# Altium schematic sheet 5v_power.SchDoc: 5V Power Regulator
size A4; Organization: OSURC Mars Rover; DocumentNumber: 8; Revision: 1; SheetNumber: 8; SheetTotal: 12
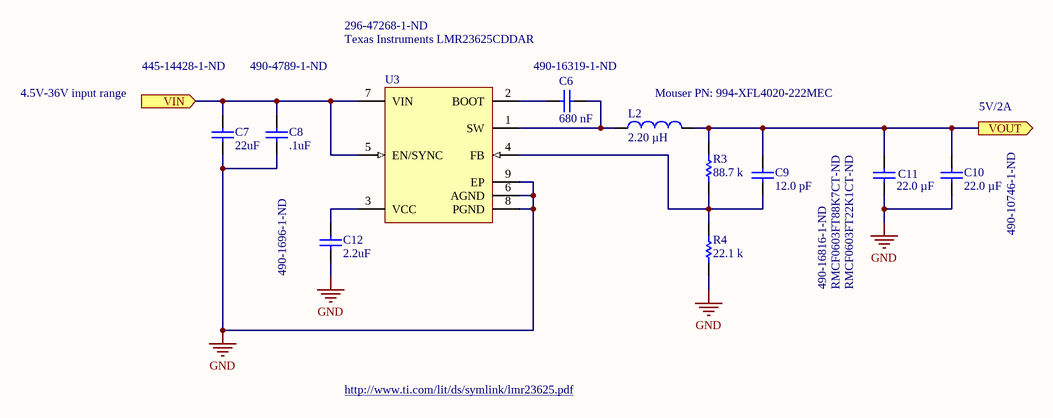
[diagram p0: 5v_power.SchDoc]

## Parts
C6  Capacitance: 680 nF  [PCB-xrh88671zmf2jss4mnlt-1]  (hidden comment: Murata GRM21BR71H684KAC4L)
C7  Capacitance: 22uF  [PCB-lllx3wppxbec679u3f24-1]  (hidden comment: Cap)
C8  Capacitance: .1uF  [CAPC2013X140X45ML15T25]  (hidden comment: Murata GCM21BR72A104KA37L)
C9  Capacitance: 12.0 pF  [PCB-xrh88671zmf2jss4mnlt-1]  (hidden comment: Murata GRM21A5C2D120JW01D)
C10  Capacitance: 22.0 µF  [PCB-xrh88671zmf2jss4mnlt-1]  (hidden comment: Murata GRM21BR61A226ME44L)
C11  Capacitance: 22.0 µF  [PCB-xrh88671zmf2jss4mnlt-1]  (hidden comment: Murata GRM21BR61A226ME44L)
C12  Capacitance: 2.2uF  [CAPC2013X135X50LL10T20]  (hidden comment: Murata GRM21BR71A225KA01L)
L2  Inductance: 2.20 µH  [PCB-9d9k809zadibtjsjgh1m-1]  (hidden comment: Coilcraft XFL4020-222MEC)
R3  Resistance: 88.7 k  [PCB-9ahxsq8gddjqcnfjmojj-1]  (hidden comment: Stackpole Electronics RMCF0603FT88K7)
R4  Resistance: 22.1 k  [PCB-9ahxsq8gddjqcnfjmojj-1]  (hidden comment: Stackpole Electronics RMCF0603FT22K1)
U3  Texas Instruments LMR23625CDDAR  [PCB-d70mjtd98i3vq9jo7u2s-1]

## Ports
VIN (in), VOUT (out)

## Nets
GND: C7.2 C8.2 C10.1 C11.1 C12.1 R4.1 U3.6(AGND) U3.8(PGND) U3.9(EP)
VIN: C7.1 C8.1 U3.5(EN/SYNC) U3.7(VIN) ; port VIN
VOUT: C9.2 C10.2 C11.2 L2.2 R3.1 ; port VOUT
NetC6_1: C6.1 L2.1 U3.1(SW)
NetC6_2: C6.2 U3.2(BOOT)
NetC9_1: C9.1 R3.2 R4.2 U3.4(FB)
NetC12_2: C12.2 U3.3(VCC)

## Notes on the sheet
- 445-14428-1-ND
- 490-4789-1-ND
- 296-47268-1-ND
- (near C6) 490-16319-1-ND
- 4.5V-36V input range
- (near L2) Mouser PN: 994-XFL4020-222MEC
- 5V/2A
- 490-1696-1-ND
- 490-16816-1-ND
- (near C11) RMCF0603FT88K7CT-ND
- (near C11) RMCF0603FT22K1CT-ND
- 490-10746-1-ND
- http://www.ti.com/lit/ds/symlink/lmr23625.pdf
- Title
- Size:
- Date:
- A4
- Engineer:
- Time:
- Sheet
- Revision:
- of
- File:

## Library data of the parts
C6 = CMP-44008e6100d59bc7-1: Cap Ceramic 0.68uF 50V X7R 10% Pad SMD 0805 125C T/R; Case/Package (SI): 2012; Voltage Rating (DC): 50.0 V; Octopart URL: https://octopart.com/grm21br71h684kac4l-murata-57369011; Manufacturer Part Number: GRM21BR71H684KAC4L; Capacitance Tolerance: ±10%; Case/Package: 0805; Dielectric Characteristic: X7R; Lifecycle Status: Active; RoHS: Compliant; Size-Length: 2.00 mm; Size-Thickness: 1.25 mm; Size-Width: 1.25 mm; OctopartID: 44008e6100d59bc7
C7 = CMP-0d44c5e3fbabd283-1: C Series 0805 22 uF 35 V ±20 % Tolerance X5R SMT Multilayer Ceramic Capacitor; Manufacturer Part Number: C2012X5R1V226M125AC; Capacitance Tolerance: ±20%; Case/Package: 0805; OctopartID: 0d44c5e3fbabd283
C8 = CMP-120358-2: CAP CER 0.1UF 100V 10% X7R 0805; Lead-Free Status: Lead Free; Voltage Rating (DC): 100.0 V; Capacitance Tolerance: ±10%; Case/Package: 0805; Dielectric Characteristic: X7R; Octopart Url: https://octopart.com/gcm21br72a104ka37l-murata-7894859; OctopartID: e2342b46b0193df3; REACH SVHC Compliance: No SVHC; RoHS: Compliant
C9 = CMP-50dd9b1f09f28f1a-1: Cap Ceramic 12pF 200V C0G 5% SMD 0805 125°C Paper T/R; Dielectric Characteristic: C0G/NP0; Octopart URL: https://octopart.com/grm21a5c2d120jw01d-murata-46693449; Manufacturer Part Number: GRM21A5C2D120JW01D; Capacitance Tolerance: ±5%; Case/Package: 0805; Mounting Style: Surface Mount; Packaging: Tape & Reel (TR); RoHS: Compliant; Size-Length: 2.00 mm; Size-Thickness: 1.00 mm; Size-Width: 1.25 mm; Voltage Rating (DC): 200 V; OctopartID: 50dd9b1f09f28f1a
C10 C11 = CMP-7d69b6ab24aca2ae-1: 0805 22 uF 10 V ±20% Tolerance X5R Multilayer Ceramic Chip Capacitor; Case/Package (SI): 2012; Lead-Free Status: Lead Free; Voltage Rating (DC): 10.0 V; Octopart URL: https://octopart.com/grm21br61a226me44l-murata-46693539; Manufacturer Part Number: GRM21BR61A226ME44L; Capacitance Tolerance: ±20%; Case/Package: 0805; Dielectric Characteristic: X5R; Lifecycle Status: Active; RoHS: Compliant; Size-Length: 2.00 mm; Size-Thickness: 1.25 mm; Size-Width: 1.25 mm; OctopartID: 7d69b6ab24aca2ae
C12 = CMP-19299739-2: CAP CER 2.2UF 10V 10% X7R 0805; Case/Package (SI): 2012; Lead-Free Status: Lead Free; Voltage Rating (DC): 10.0 V; Capacitance Tolerance: ±10%; Dielectric Characteristic: X7R; Lifecycle Status: Active; Mounting Style: Surface Mount; Number of Pins: 2; Octopart Url: https://octopart.com/grm21br71a225ka01l-murata-196409; OctopartID: f7633e6b2d3c28a4; REACH SVHC Compliance: No SVHC; RoHS: Compliant; Size-Height: 0.00125 m; Size-Length: 0.002 m; Size-Thickness: 0.00125 m; Size-Width: 0.00125 m
L2 = CMP-3796fe24315fe851-1: Power inductor, shielded, 20% tol, SMT, RoHS, halogen free; Lead-Free Status: Contains Lead; Self Resonant Frequency: 38.0 MHz; Octopart URL: https://octopart.com/xfl4020-222mec-coilcraft-12067759; Manufacturer Part Number: XFL4020-222MEC; Lifecycle Status: Active; Mounting Style: Surface Mount; Packaging: Tape & Reel (TR), Cut Tape (CT); REACH SVHC Compliance: No SVHC; RoHS: Compliant; OctopartID: 3796fe24315fe851
R3 = CMP-fc30341ff50423f7-1: RMCF Series 0603 0.1 W 88.7 kOhm ±1 % ±100 ppm/°C SMT Thick Film Chip Resistor; Lead-Free Status: Lead Free; Power Rating: 100 mW; Resistance Tolerance: ±1%; Octopart URL: https://octopart.com/rmcf0603ft88k7-stackpole+electronics-19213394; Manufacturer Part Number: RMCF0603FT88K7; Case/Package: 0603; Mounting Style: Surface Mount; Packaging: Tape & Reel (TR); RoHS: Compliant; OctopartID: fc30341ff50423f7
R4 = CMP-f875305af60927b2-1: RMCF Series 0603 0.1 W 22.1 kOhm ±1 % ±100 ppm/°C SMT Thick Film Chip Resistor; Lead-Free Status: Lead Free; Power Rating: 100 mW; Resistance Tolerance: ±1%; Octopart URL: https://octopart.com/rmcf0603ft22k1-stackpole+electronics-19213082; Manufacturer Part Number: RMCF0603FT22K1; Case/Package: 0603; Mounting Style: Surface Mount; Packaging: Tape & Reel (TR); RoHS: Compliant; OctopartID: f875305af60927b2
U3 = CMP-9dcb50cfc7eb420c-1: SIMPLE SWITCHER?, 36V 2.5A Synchronous Step-Down Converter 8-SO PowerPAD -40 to 125; Quiescent Current: 75.0 µA; Lead-Free Status: Lead Free; Number of Regulated Outputs: 1; Manufacturer Part Number: LMR23625CDDAR; RoHS: Compliant; Case/Package: HSOP; Octopart URL: http://octopart.com/lmr23625cddar-texas+instruments-68058950; OctopartID: 9dcb50cfc7eb420c; Lifecycle Status: Active